# EAGLE design modulo motores (EAGLE 9.2.1)
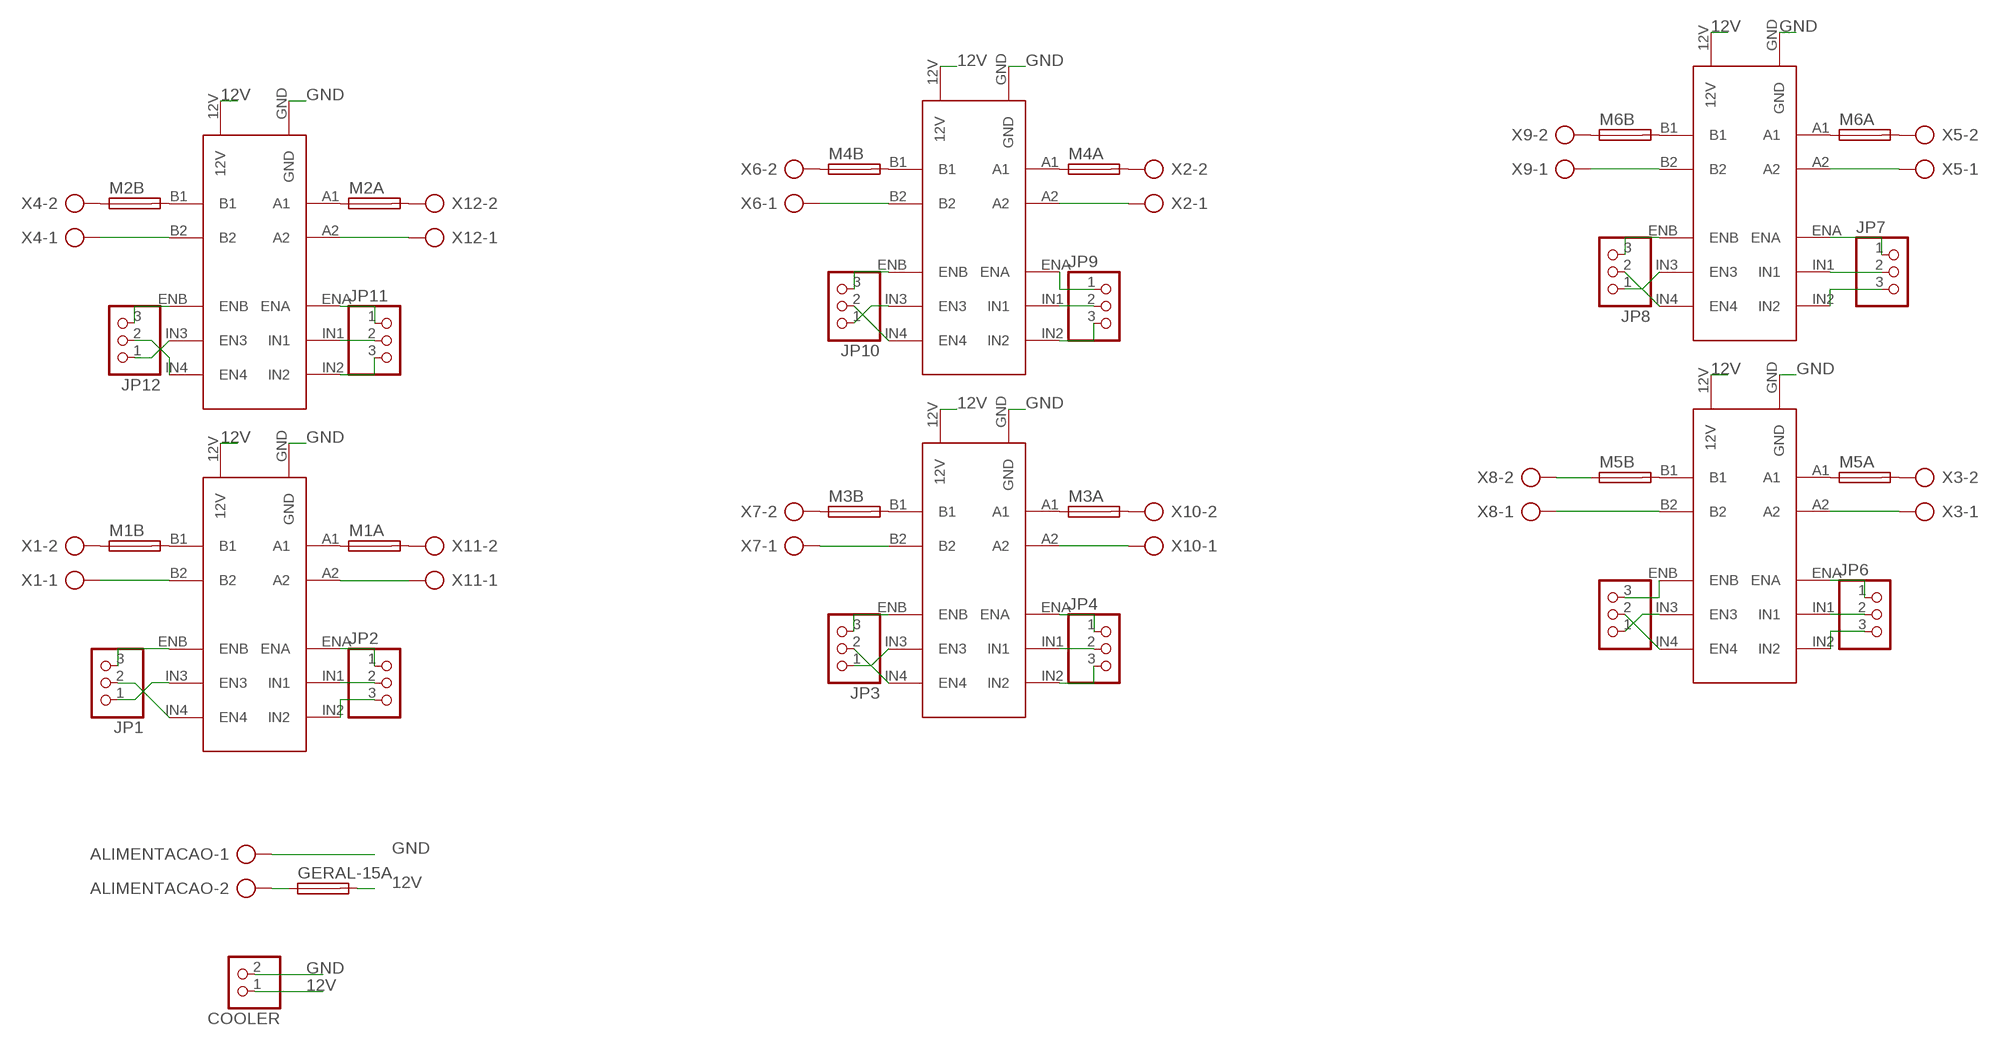
[diagram p0: schematic, sheet 1]

## Parts
ALIMENTACAO  AK500/2  [AK500/2]
COOLER  PINHD-1X2  [1X02]
GERAL-15A  SH22,5A  [SH22,5A]
JP1  PINHD-1X3  [1X03]
JP2  PINHD-1X3  [1X03]
JP3  PINHD-1X3  [1X03]
JP4  PINHD-1X3  [1X03]
JP5  PINHD-1X3  [1X03]
JP6  PINHD-1X3  [1X03]
JP7  PINHD-1X3  [1X03]
JP8  PINHD-1X3  [1X03]
JP9  PINHD-1X3  [1X03]
JP10  PINHD-1X3  [1X03]
JP11  PINHD-1X3  [1X03]
JP12  PINHD-1X3  [1X03]
M1  L298N  [L298N]
M1A  SH22,5A  [SH22,5A]
M1B  SH22,5A  [SH22,5A]
M2  L298N  [L298N]
M2A  SH22,5A  [SH22,5A]
M2B  SH22,5A  [SH22,5A]
M3  L298N  [L298N]
M3A  SH22,5A  [SH22,5A]
M3B  SH22,5A  [SH22,5A]
M4A  SH22,5A  [SH22,5A]
M4B  SH22,5A  [SH22,5A]
M5  L298N  [L298N]
M5A  SH22,5A  [SH22,5A]
M5B  SH22,5A  [SH22,5A]
M6  L298N  [L298N]
M6A  SH22,5A  [SH22,5A]
M6B  SH22,5A  [SH22,5A]
U$2  L298N  [L298N]
X1  AK500/2  [AK500/2]
X2  AK500/2  [AK500/2]
X3  AK500/2  [AK500/2]
X4  AK500/2  [AK500/2]
X5  AK500/2  [AK500/2]
X6  AK500/2  [AK500/2]
X7  AK500/2  [AK500/2]
X8  AK500/2  [AK500/2]
X9  AK500/2  [AK500/2]
X10  AK500/2  [AK500/2]
X11  AK500/2  [AK500/2]
X12  AK500/2  [AK500/2]

## Nets
12V: COOLER.1 GERAL-15A.2 M1.12V M2.12V M3.12V M5.12V M6.12V U$2.12V
GND: ALIMENTACAO.1 COOLER.2 M1.GND M2.GND M3.GND M5.GND M6.GND U$2.GND
N$1: M1.A1 M1A.1
N$2: M1.B1 M1B.2
N$3: M2.A1 M2A.1
N$4: M2.B1 M2B.2
N$5: M4A.1 U$2.A1
N$6: M4B.2 U$2.B1
N$7: M3.B1 M3B.2
N$8: M3.A1 M3A.1
N$9: M5.B1 M5B.2
N$10: M5.A1 M5A.1
N$11: M6.A1 M6A.1
N$12: M6.B1 M6B.2
N$13: M4A.2 X2.2
N$14: M5.A2 X3.1
N$15: M5A.2 X3.2
N$16: M6A.2 X5.2
N$17: M1B.1 X1.2
N$18: M5B.1 X8.2
N$19: M2B.1 X4.2
N$20: M4B.1 X6.2
N$21: M3A.2 X10.2
N$22: M1A.2 X11.2
N$23: M2A.2 X12.2
N$24: M3B.1 X7.2
N$25: JP12.3 M2.ENB
N$26: JP12.1 M2.IN3(EN3)
N$27: JP12.2 M2.IN4(EN4)
N$28: JP11.1 M2.ENA
N$29: JP11.2 M2.IN1
N$30: JP11.3 M2.IN2
N$31: JP3.2 M3.IN4(EN4)
N$32: JP10.3 U$2.ENB
N$33: JP3.1 M3.IN3(EN3)
N$34: JP9.1 U$2.ENA
N$35: JP9.2 U$2.IN1
N$36: JP9.3 U$2.IN2
N$37: JP10.2 U$2.IN4(EN4)
N$38: JP8.3 M6.ENB
N$39: JP10.1 U$2.IN3(EN3)
N$40: JP7.2 M6.IN1
N$41: JP7.1 M6.ENA
N$42: JP7.3 M6.IN2
N$43: JP6.2 M5.IN1
N$44: JP6.1 M5.ENA
N$45: JP6.3 M5.IN2
N$46: JP8.2 M6.IN4(EN4)
N$47: JP5.3 M5.ENB
N$48: JP8.1 M6.IN3(EN3)
N$49: JP4.1 M3.ENA
N$50: JP4.2 M3.IN1
N$51: JP4.3 M3.IN2
N$52: JP5.2 M5.IN4(EN4)
N$53: JP5.1 M5.IN3(EN3)
N$54: JP3.3 M3.ENB
N$55: JP2.2 M1.IN1
N$56: JP2.1 M1.ENA
N$57: JP2.3 M1.IN2
N$58: JP1.2 M1.IN4(EN4)
N$59: JP1.1 M1.IN3(EN3)
N$60: JP1.3 M1.ENB
N$61: M6B.1 X9.2
N$62: ALIMENTACAO.2 GERAL-15A.1
N$64: M5.B2 X8.1
N$65: M6.A2 X5.1
N$66: M6.B2 X9.1
N$67: M3.A2 X10.1
N$68: U$2.A2 X2.1
N$69: U$2.B2 X6.1
N$70: M3.B2 X7.1
N$71: M2.A2 X12.1
N$72: M1.A2 X11.1
N$73: M2.B2 X4.1
N$75: M1.B2 X1.1

## Library data of the parts
ALIMENTACAO X1-X12 = con-ptr500:AK500/2: CONNECTOR; OC_FARNELL: unknown; OC_NEWARK: unknown
COOLER = pinhead:PINHD-1X2: PIN HEADER
GERAL-15A M1A M1B M2A M2B M3A M3B M4A M4B M5A M5B M6A M6B = fuse:SH22,5A: FUSE HOLDER grid 22,5mm, isolated cap OGN0031 8201, Schurter (Buerklin); MPN: 0031.7701.11; OC_FARNELL: unknown; OC_NEWARK: 04F1224
JP1-JP12 = pinhead:PINHD-1X3: PIN HEADER
M1-M3 M5 M6 U$2 = acvoid:L298N

## Board
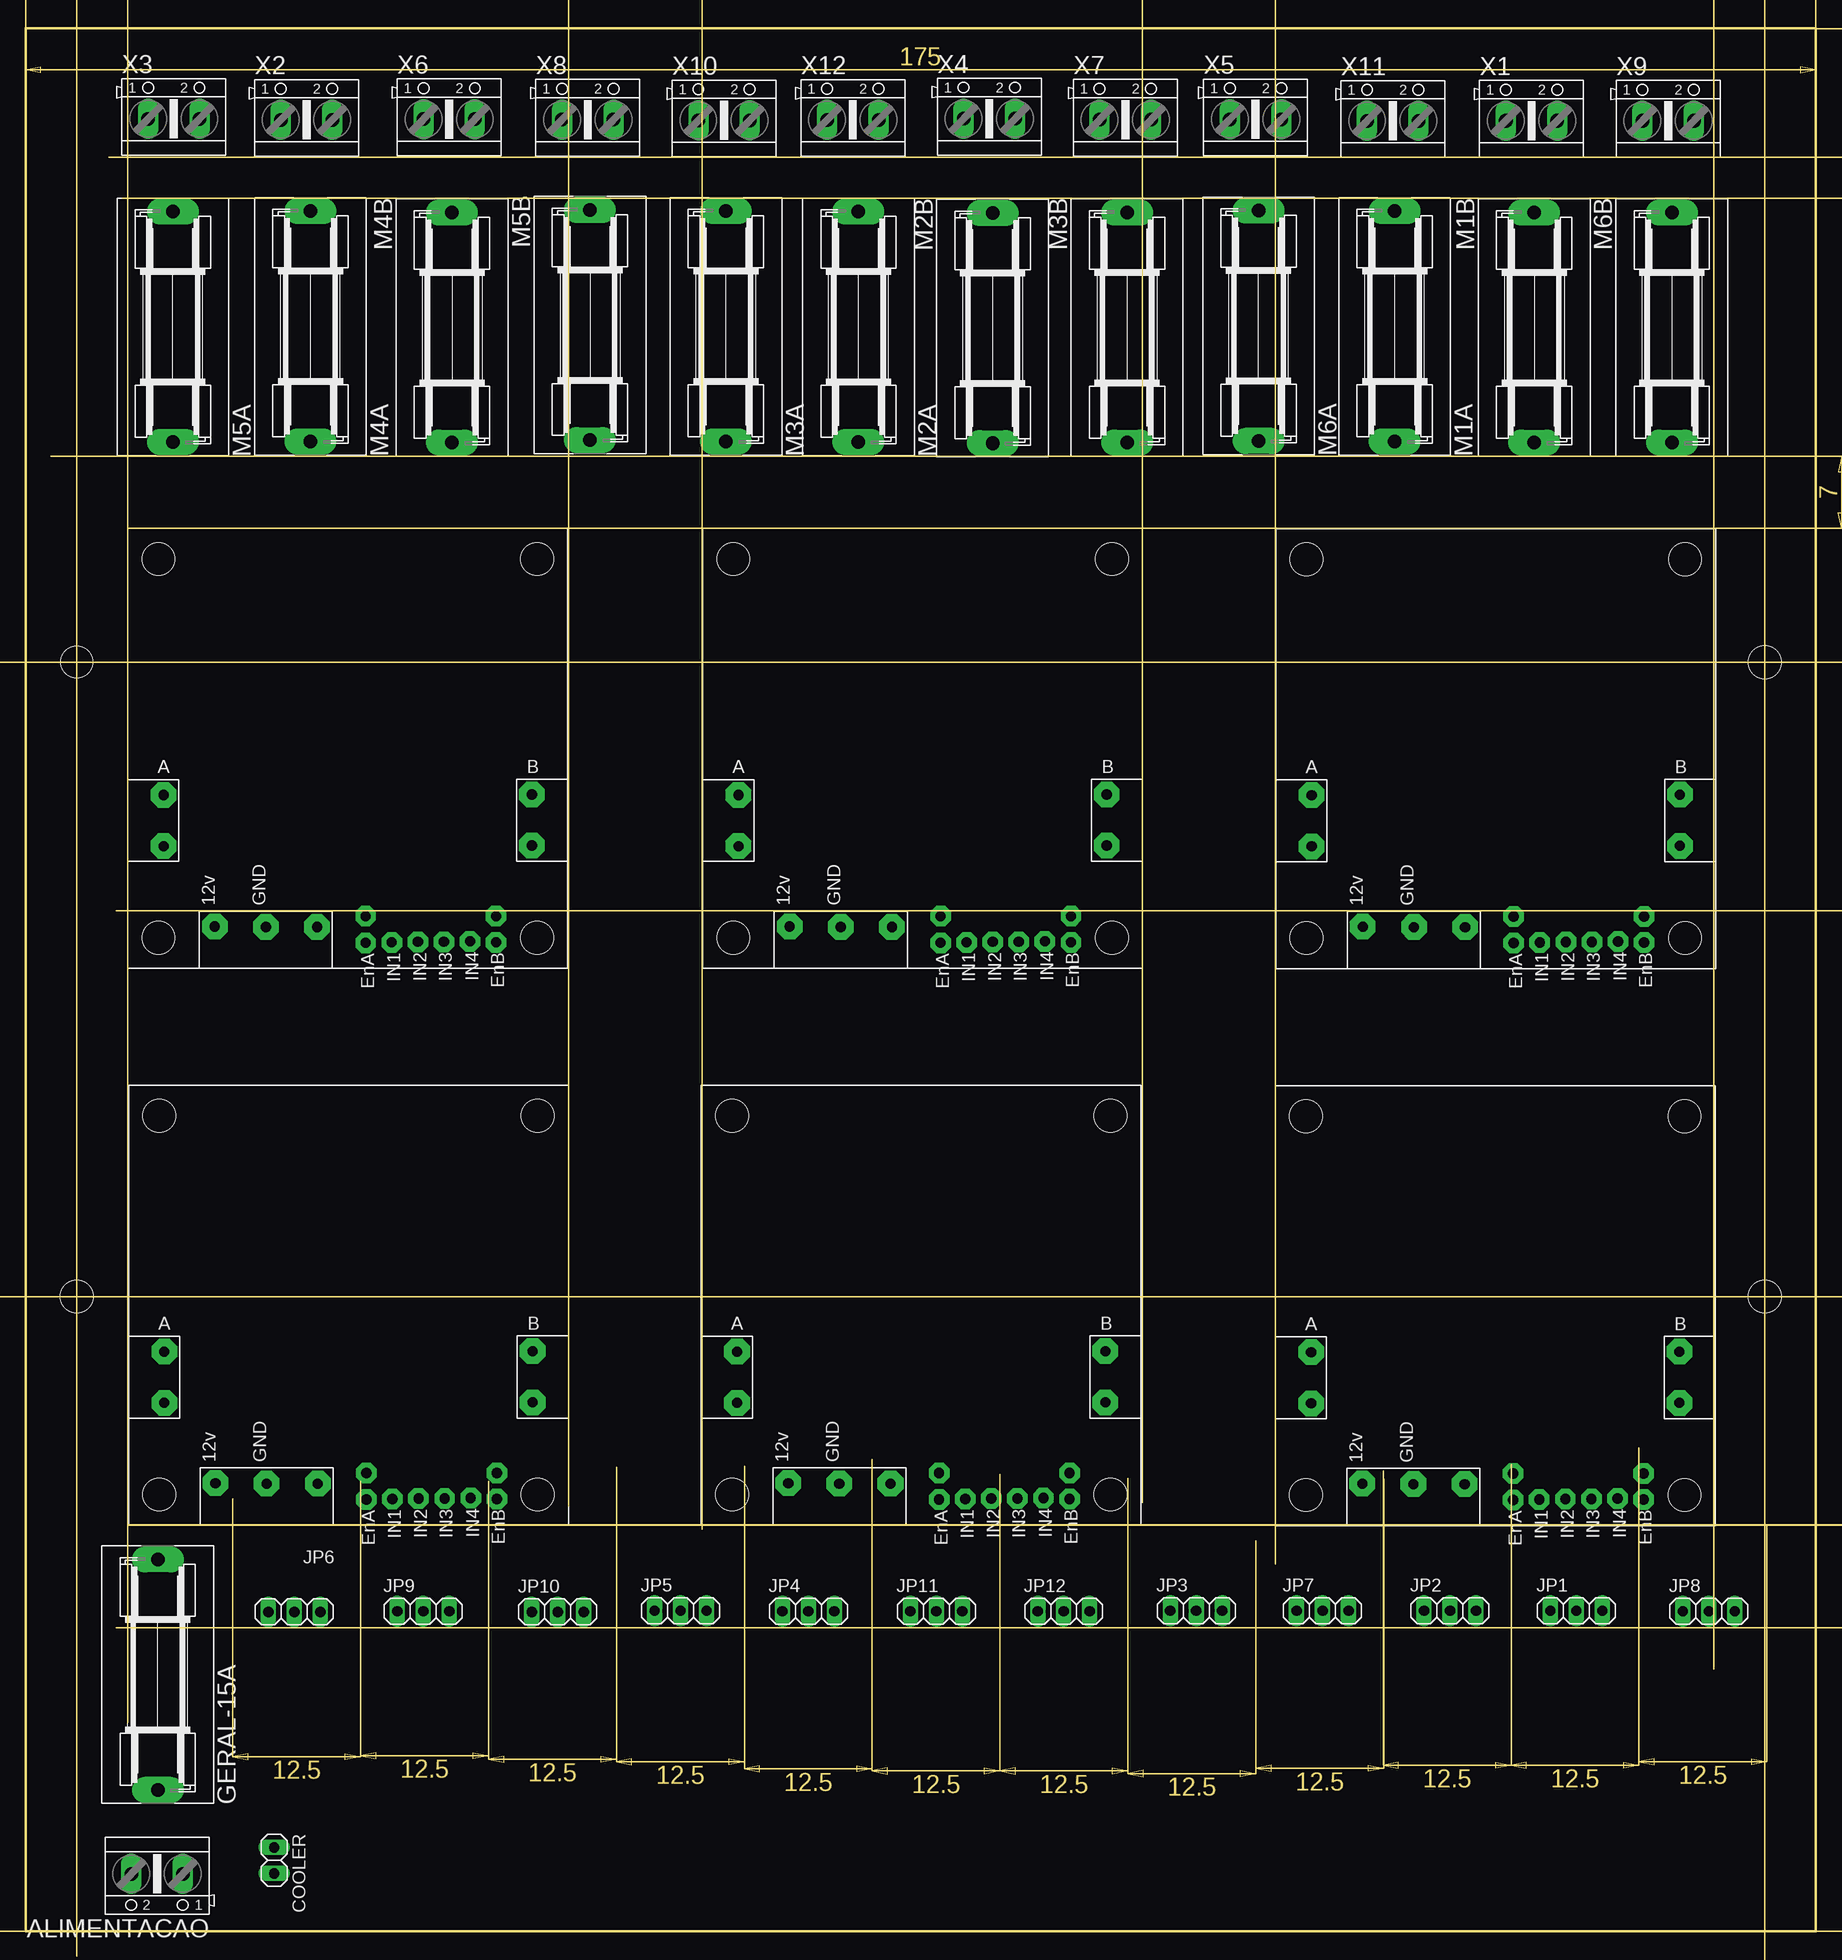
[diagram p1: board, top side]
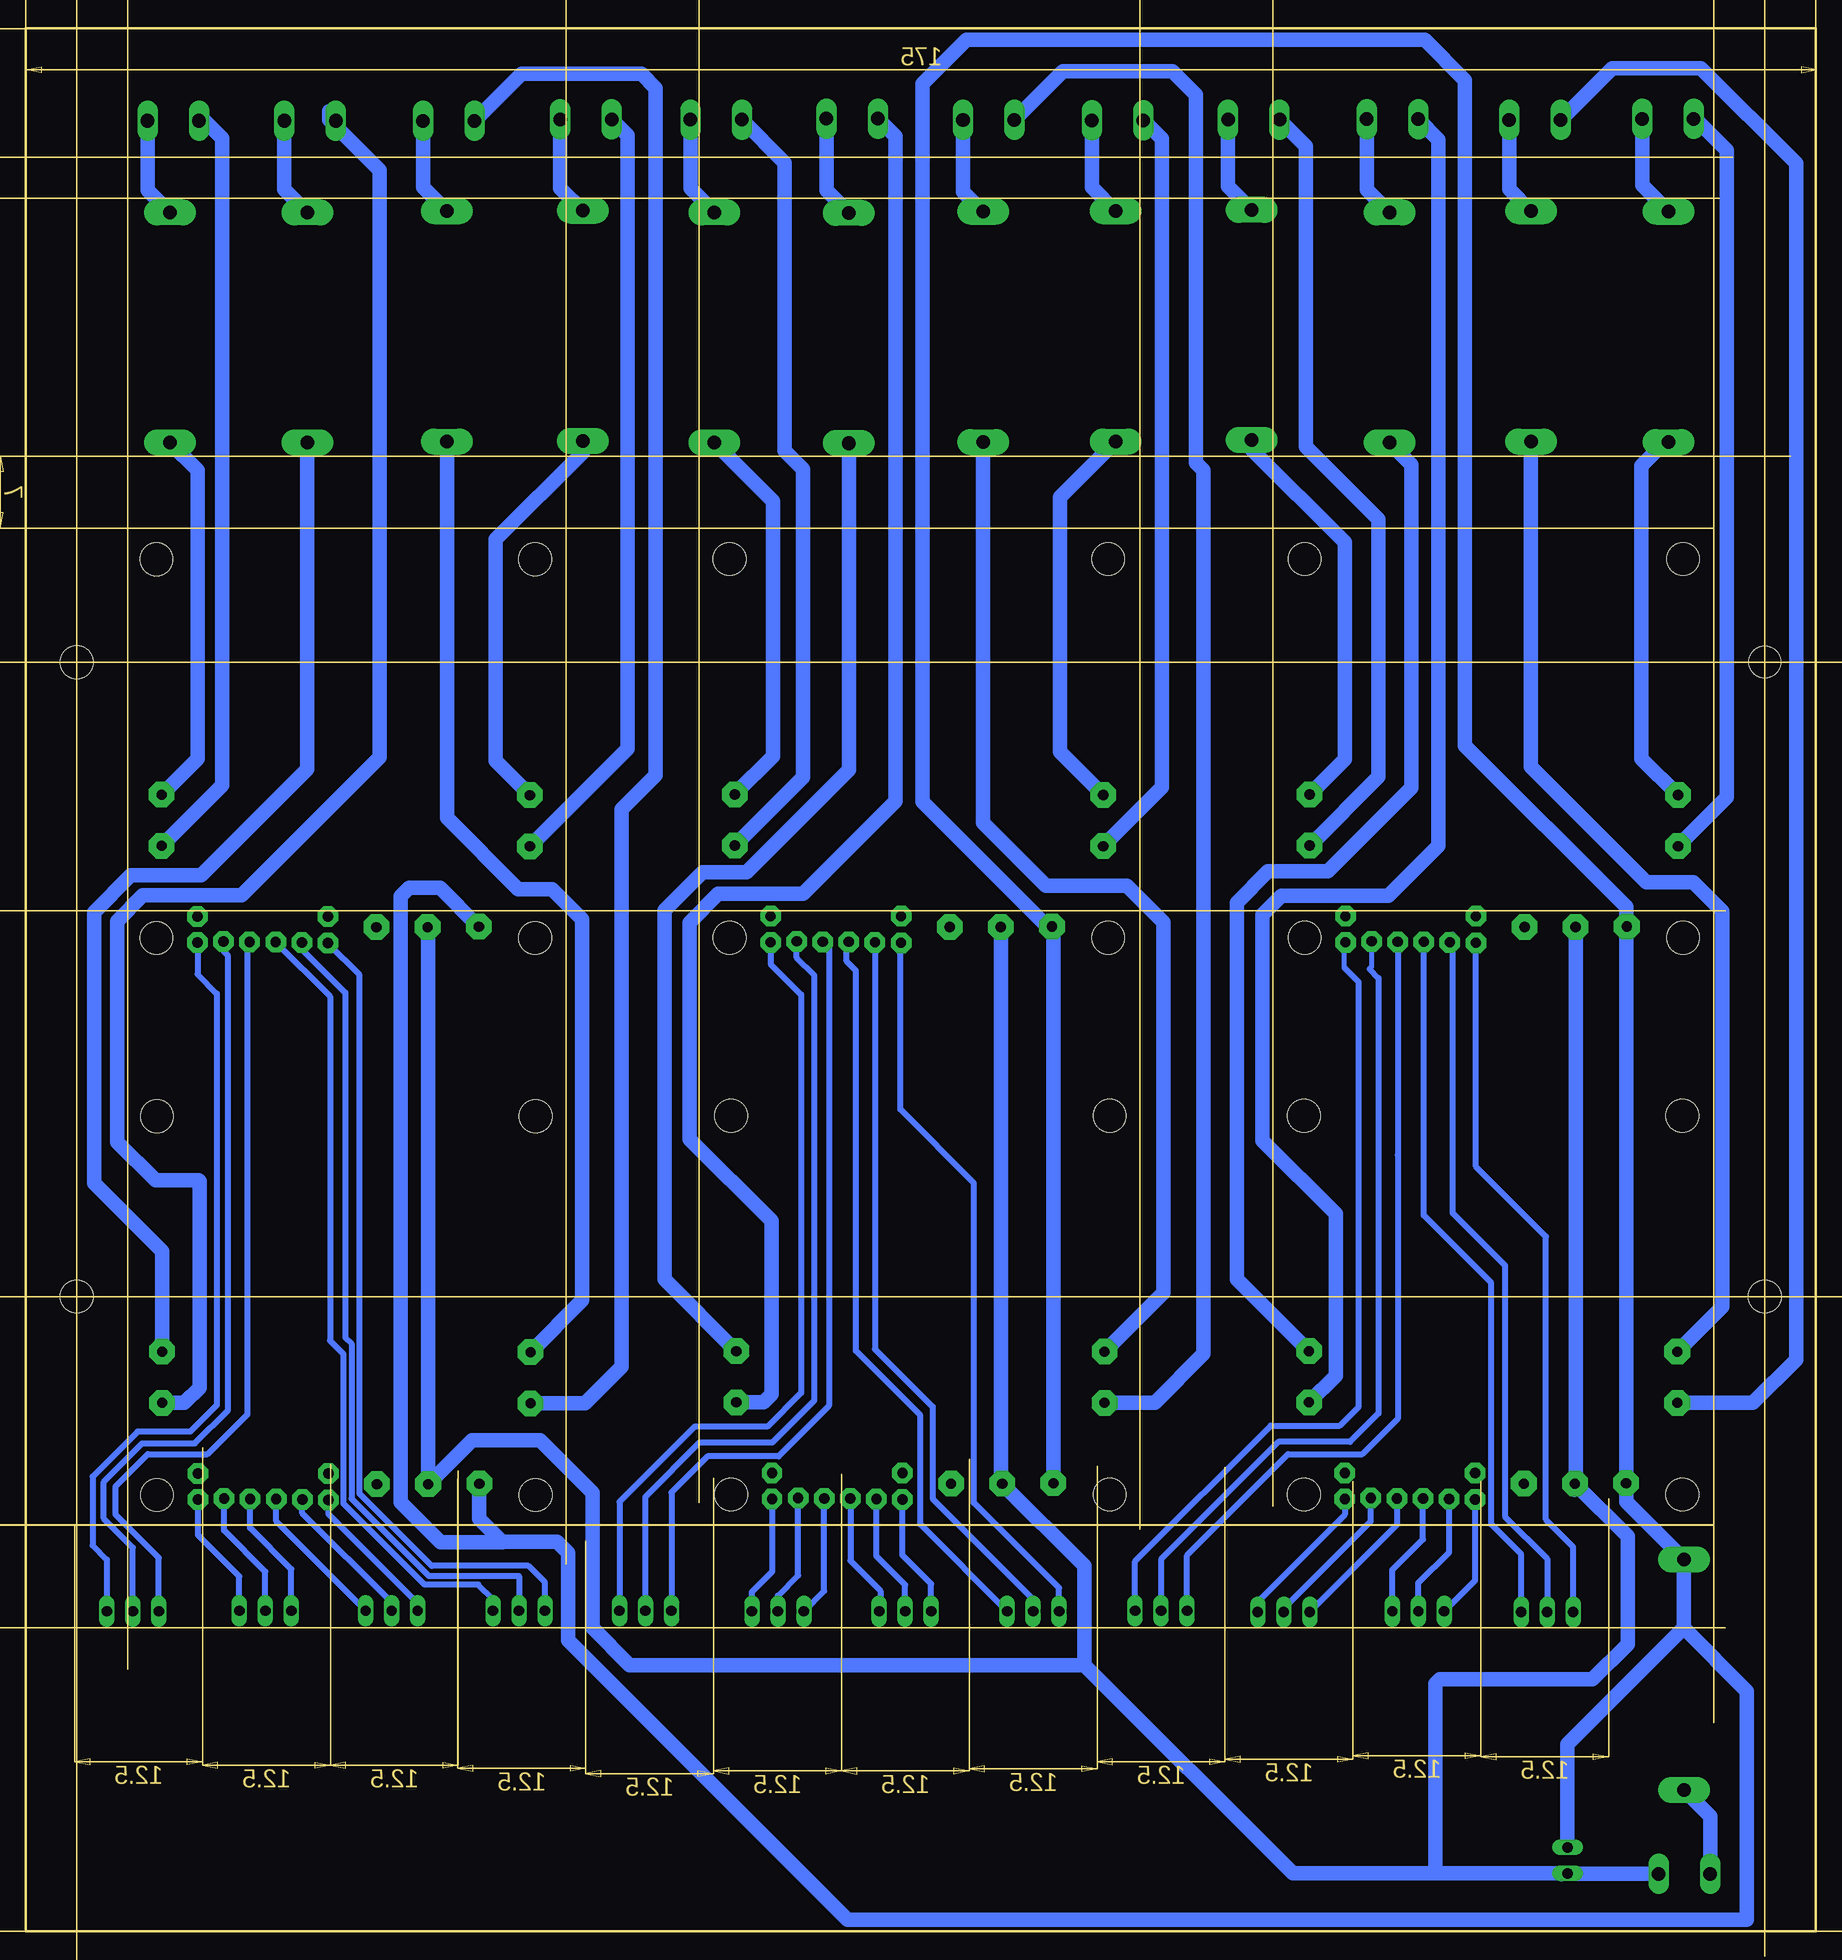
[diagram p2: board, bottom side, seen from below]

Size 175 x 185.95 mm. Coordinates in mm from the lower left corner, seen from the top.
Outline: 0,185.95 175,185.95 175,0 0,0 0,185.95
Copper layers (1*16): Top 0.035mm / dielectric 1.5mm / Bottom 0.035mm
Design rules "default": minimum track width 6mil, minimum drill 0.35mm, track to track 6mil, track to pad 6mil, pad to pad 6mil, via to via 6mil, smd to smd 6mil, copper to edge 40mil, drill to drill 6mil, minimum pad ring 10mil, minimum via ring 8mil, stop-mask expansion 4mil, vias tented up to drill 0mil, thermal gap 10mil
Holes 3.2 mm at 5,62 170,62 170,124
Holes 3.1 mm at 5,124
Milling: area -0.1,181.6 to 1.4,182.2; area 173.4,181.6 to 174.9,182.2; area 85.4,182.3 to 89.5,184.1; area 0,196.3 to 1.5,196.9; area 8.5,196.3 to 10,196.9; area 3.6,197 to 6.4,198.8; area 173.5,193.2 to 175,193.8; area 165,193.2 to 166.5,193.8; area 168.6,191.3 to 171.4,193.1; area 53.1,212.2 to 54.6,212.8; area 64.6,212.2 to 66.1,212.8; area 58.2,212.9 to 61,214.6; 66 more areas; 78 lines

### Footprints (pad centres in the part's own frame; a part is rotated, then mirrored left to right if it is on the bottom)
AK500/2 = drill 1.321 long: 1 -2.515,0; 2 2.515,0
1X02 = drill 1.016 long: 1 -1.27,0; 2 1.27,0
SH22,5A = drill 1.321 pad 2.54 long: 1 -11.252,0; 2 11.252,0
1X03 = drill 1.016 long: 1 -2.54,0; 2 0,0; 3 2.54,0
L298N = drill 1 pad 2.5 octagon: 12V 8.5,4.1; A1 3.5,16.95; A2 3.5,11.95; B1 39.5,17; B2 39.5,12; GND 13.5,4.05; P$7 18.5,4.05 | drill 1 pad 2 octagon: ENA 23.25,2.5; ENB 36,2.55; IN1 25.8,2.55; IN2 28.35,2.6; IN3 30.9,2.6; IN4 33.45,2.65; P$9 36,5.1; P$14 23.25,5.1 | hole 3.2: 3,40; 40,40; 40,3; 3,3

### Placement (x,y rotation side)
ALIMENTACAO  12.86,5.6 180 top
COOLER  24.3,6.9 270 top
GERAL-15A  12.92,25.06 90 top
JP1  151.57,31.3 0 top
JP2  139.22,31.3 0 top
JP3  114.42,31.3 0 top
JP4  76.52,31.25 0 top
JP5  64.02,31.3 0 top
JP6  26.27,31.2 0 top
JP7  126.77,31.3 0 top
JP8  164.52,31.25 0 top
JP9  38.87,31.25 0 top
JP10  52.02,31.2 0 top
JP11  89.02,31.25 0 top
JP12  101.47,31.25 0 top
M1  122.15,39.62 0 top
M1A  133.82,156.81 90 top
M1B  147.46,156.69 270 top
M2  66.04,39.67 0 top
M2A  81.41,156.76 90 top
M2B  94.52,156.64 270 top
M3  66.18,94.07 0 top
M3A  68.46,156.81 90 top
M3B  107.66,156.69 270 top
M4A  27.85,156.81 90 top
M4B  41.68,156.69 270 top
M5  9.99,94.07 0 top
M5A  14.4,156.76 90 top
M5B  55.17,156.94 270 top
M6  122.2,94.05 0 top
M6A  120.52,156.86 90 top
M6B  160.91,156.69 270 top
U$2  10.06,39.67 0 top
X1  147.2,176.9 0 top
X2  27.46,176.99 0 top
X3  14.48,177.09 0 top
X4  94.2,177.1 0 top
X5  120.22,177.04 0 top
X6  41.4,177.05 0 top
X7  107.5,177 0 top
X8  54.95,177 0 top
X9  160.55,176.9 0 top
X10  68.27,176.94 0 top
X11  133.64,176.89 0 top
X12  80.86,176.99 0 top

### Tracks (layer width: path | path; a pad name or v marks a point on that pad's centre or on a via)
12V
  Bottom 1.4: 18.56,98.1 U$2.12V 18.56,41.95 GERAL-15A.2 12.92,29.63 | 18.56,98.1 M5.12V | M1.12V 130.65,40.3 128.4,38.05 | 128.4,38.05 128.35,38 134.45,38 138.35,41.9 138.35,101.1 137.5,101.95 134.5,101.95 M6.12V | 128.4,38.05 123.05,38.05 121.95,36.95 121.95,28.4 94.65,1.1 6.75,1.1 6.75,23.46 12.92,29.63 | M2.12V 74.54,97.51 74.4,97.65 74.68,97.93 M3.12V 75.17,98.17 87.35,110.35 87.35,180.5 83.05,184.8 38.25,184.8 34.3,180.85 34.3,115.85 18.56,100.11 18.56,98.1 | COOLER.1 24.3,18.25 12.92,29.63
GND
  Bottom 1.4: M5.GND 23.49,43.26 23.56,43.19 | 23.6,43.15 23.56,43.19 | 23.56,43.19 U$2.GND 18.4,38.56 18.4,28.05 21.85,24.6 36.75,24.6 37.2,24.15 37.2,5.63 | ALIMENTACAO.1 24.85,5.6 | 24.85,5.6 24.9,5.55 | 24.85,5.6 24.82,5.63 COOLER.2 37.2,5.63 | 71.5,26 71.5,35.68 M2.GND 79.68,43.86 M3.GND | 37.2,5.63 51.13,5.63 71.5,26 | 71.5,26 115.95,26 119.6,29.65 119.6,42.85 124.7,47.95 131.37,47.95 M1.GND 135.65,98.05 M6.GND
N$1
  Bottom 1.4: M1.A1 120.6,61.62 120.6,98.85 123.55,101.8 126.85,101.8 133.82,108.77 M1A.1
N$2
  Bottom 1.4: M1B.2 147.46,113.54 157.85,103.15 164.7,103.15 168.3,99.55 168.3,73.07 161.65,66.42 M1.B1
N$3
  Bottom 1.4: M2.A1 63.8,62.36 63.8,98.6 67.35,102.15 75.25,102.15 81.41,108.31 M2A.1
N$4
  Bottom 1.4: M2B.2 94.52,113.48 104.55,103.45 108.85,103.45 112.55,99.75 112.55,63.68 M2.B1
N$5
  Bottom 1.4: M4A.1 27.86,113.76 16.6,102.5 12,102.5 9.15,99.65 9.15,61.03 U$2.A1
N$6
  Bottom 1.4: M4B.2 39.55,143.31 39.55,111.7 47.7,103.55 53.55,103.55 56.6,100.5 56.6,63.71 U$2.B1
N$7
  Bottom 1.4: M3.B1 101.95,114.8 101.95,139.73 M3B.2
N$8
  Bottom 1.4: M3.A1 73.9,115.24 73.9,140.12 M3A.1
N$9
  Bottom 1.4: M5.B1 46.05,114.51 46.05,135.7 55.17,144.82 M5B.2
N$10
  Bottom 1.4: M5.A1 17.05,114.58 17.05,143.2 14.4,145.85 | 14.25,146 14.4,145.85 | 14.4,145.85 M5A.1
N$11
  Bottom 1.4: M6.A1 129.05,114.35 129.05,136 120.52,144.53 M6A.1
N$12
  Bottom 1.4: M6.B1 158.2,114.55 158.2,142.73 M6B.2
N$13
  Bottom 1.4: M4A.2 29.97,170.19 X2.2
N$14
  Bottom 1.4: M5.A2 8.7,110.81 8.7,174 11.96,177.27 | 12.25,177.55 11.96,177.27 | 11.96,177.27 X3.1
N$15
  Bottom 1.4: M5A.2 17,170.61 X3.2
N$16
  Bottom 1.4: M6A.2 122.73,170.33 X5.2
N$17
  Bottom 1.4: M1B.1 149.71,170.2 X1.2
N$18
  Bottom 1.4: M5B.1 57.47,170.49 X8.2
N$19
  Bottom 1.4: M2B.1 96.72,170.09 X4.2
N$20
  Bottom 1.4: M4B.1 43.92,170.18 X6.2
N$21
  Bottom 1.4: M3A.2 70.78,170.39 X10.2
N$22
  Bottom 1.4: M1A.2 136.16,170.4 X11.2
N$23
  Bottom 1.4: M2A.2 83.38,169.98 X12.2
N$24
  Bottom 1.4: M3B.1 110.02,170.3 X7.2
N$25
  Bottom 0.6: JP12.3 104.01,33.14 102,35.15 102,42.18 M2.ENB
N$26
  Bottom 0.6: JP12.1 96.94,33.24 M2.IN3
N$27
  Bottom 0.6: JP12.2 101.47,32.78 99.49,34.76 M2.IN4
N$28
  Bottom 0.6: JP11.1 86.48,33.93 89.29,36.74 M2.ENA
N$29
  Bottom 0.6: JP11.2 89.02,33.82 91.85,36.65 M2.IN1
N$30
  Bottom 0.6: M2.IN2 94.39,36.19 91.45,33.25 91.45,31.36 JP11.3
N$31
  Bottom 0.6: JP3.2 114.42,42.43 109.1,47.75 102,47.75 97.9,51.85 97.9,93.4 99.63,95.13 M3.IN4
N$32
  Bottom 0.6: U$2.ENB 46.06,40.69 54.56,32.19 JP10.3
N$33
  Bottom 0.6: JP3.1 111.88,42.87 108.35,46.4 101.4,46.4 96.48,51.32 96.48,96.67 M3.IN3
N$34
  Bottom 0.6: JP9.1 33.31,34.27 U$2.ENA
N$35
  Bottom 0.6: JP9.2 38.87,34.03 35.86,37.04 U$2.IN1
N$36
  Bottom 0.6: JP9.3 41.41,35.29 38.41,38.29 U$2.IN2
N$37
  Bottom 0.6: JP10.2 52.02,31.53 43.51,40.04 U$2.IN4
N$38
  Bottom 0.6: M6.ENB 158.2,93.5 156.3,91.6 156.3,51.4 158.9,48.8 164.05,48.8 168.45,44.4 168.45,37.7 167.06,36.31 JP8.3
N$39
  Bottom 0.6: U$2.IN3 40.96,39.72 JP10.1
N$40
  Bottom 0.6: M6.IN1 148,95.95 143.75,91.7 143.75,58 143.15,57.4 143.15,42.25 135.6,34.7 126.8,34.7 126.77,34.67 JP7.2
N$41
  Bottom 0.6: JP7.1 124.23,34.08 125.85,35.7 135.3,35.7 142.35,42.75 142.35,93.45 M6.ENA
N$42
  Bottom 0.6: JP7.3 129.31,32.41 130.75,33.85 136,33.85 143.95,41.8 143.95,56.4 145.25,57.7 145.25,91.35 M6.IN2
N$43
  Bottom 0.5: M5.IN1 35.54,96.87 35.54,97.37
  Bottom 0.6: 35.54,97.37 35.54,70.19 30.4,65.05 30.4,40.5 26.27,36.37 JP6.2
N$44
  Bottom 0.6: JP6.1 23.73,37.53 26.4,40.2 26.4,67.85 33.24,74.69 M5.ENA
N$45
  Bottom 0.6: JP6.3 28.81,36.81 31.75,39.75 31.75,63.35 38.34,69.94 M5.IN2
N$46
  Bottom 0.6: JP8.2 164.52,37.47 167.35,40.3 167.35,43.9 163.6,47.65 158.45,47.65 155.2,50.9 155.2,95.3 155.65,95.75 M6.IN4
N$47
  Bottom 0.5: 46.09,94.12 46.09,96.52 M5.ENB
  Bottom 0.6: JP5.3 66.56,36.14 53.3,49.4 46.55,49.4 44.7,51.25 44.7,92.73 46.09,94.12
N$48
  Bottom 0.6: JP8.1 161.98,36.48 166.2,40.7 166.2,43.45 163.05,46.6 157.2,46.6 153.3,50.5 153.3,96.45 M6.IN3
N$49
  Bottom 0.6: JP4.1 73.98,33.53 82.3,41.85 82.3,73.1 89.5,80.3 89.5,96.5 M3.ENA
N$50
  Bottom 0.6: M3.IN1 91.98,56.88 86.35,51.25 86.35,42.25 76.52,32.42 JP4.2
N$51
  Bottom 0.6: JP4.3 87.55,39.74 87.55,50.4 93.85,56.7 93.85,93.85 94.75,94.75 94.75,96.45 M3.IN2
N$52
  Bottom 0.5: M5.IN4 43.44,94.22 43.64,94.02
  Bottom 0.6: 43.64,94.02 42.75,93.13 42.75,50.6 45.55,47.8 52.55,47.8 64.02,36.33 JP5.2
N$53
  Bottom 0.6: JP5.1 61.48,36.72 51.6,46.6 44.35,46.6 40.89,50.06 40.89,75.85 M5.IN3
N$54
  Bottom 0.6: M3.ENB 102.18,94.48 99.2,91.5 99.2,52.6 102.5,49.3 109.6,49.3 116.96,41.94 JP3.3
N$55
  Bottom 0.6: JP2.2 139.22,32.12 147.95,40.85 M1.IN1
N$56
  Bottom 0.6: JP2.1 136.68,32.03 145.4,40.75 M1.ENA
N$57
  Bottom 0.6: JP2.3 150.5,40.04 M1.IN2
N$58
  Bottom 0.6: JP1.2 151.57,35.12 155.6,39.15 M1.IN4
N$59
  Bottom 0.6: JP1.1 149.03,35.38 153.05,39.4 M1.IN3
N$60
  Bottom 0.6: JP1.3 154.11,34.66 158.15,38.7 M1.ENB
N$61
  Bottom 1.4: M6B.1 163.06,170.1 X9.2
N$62
  Bottom 1.4: ALIMENTACAO.2 10.34,11.23 GERAL-15A.1
N$64
  Bottom 1.4: M5.B2 42.75,112.81 42.75,137.95 49.85,145.05 49.85,174.42 X8.1
N$65
  Bottom 1.4: M6.A2 116.15,115.55 116.15,175.49 X5.1
N$66
  Bottom 1.4: M6.B2 155.8,111.95 155.8,175.2 158.03,177.44 | 158.1,177.5 158.03,177.44 | 158.03,177.44 X9.1
N$67
  Bottom 1.4: M3.A2 63.95,111.75 63.95,175.14 X10.1
N$68
  Bottom 1.4: X2.1 19.88,182.05 11.25,182.05 1.95,172.75 1.95,55.83 6.16,51.62 U$2.A2
N$69
  Bottom 1.4: U$2.B2 46.95,54.28 46.95,70.1 54.1,77.25 54.1,99.3 52.25,101.15 41.8,101.15 36.9,106.05 36.9,175.06 X6.1
N$70
  Bottom 1.4: M3.B2 99,112.75 99,142.85 100.8,144.65 100.8,172.81 X7.1
N$71
  Bottom 1.4: M2.A2 64.63,51.62 59.85,56.4 59.85,142.75 60.6,143.5 60.6,179.45 62.9,181.75 73.59,181.75 X12.1
N$72
  Bottom 1.4: M1.A2 120.33,51.57 116.75,55.15 116.75,109.6 113.4,112.95 113.4,180.1 114.8,181.5 126.52,181.5 X11.1
N$73
  Bottom 1.4: M2.B2 102.88,51.67 102.1,52.45 102.1,69.4 110.1,77.4 110.1,98.55 107.3,101.35 99,101.35 89.95,110.4 89.95,175.37 X4.1
N$75
  Bottom 1.4: M1.B2 159.48,51.62 158,53.1 158,73.25 158.1,73.35 162.3,73.35 166.05,77.1 166.05,98.7 163.55,101.2 153.9,101.2 140.4,114.7 140.4,172.05 145.35,177 145.35,177.85 144.69,177.19 X1.1